# EAGLE design LB-BIT-w2_BRANCH-v03(3_3) (EAGLE 6.6.0)
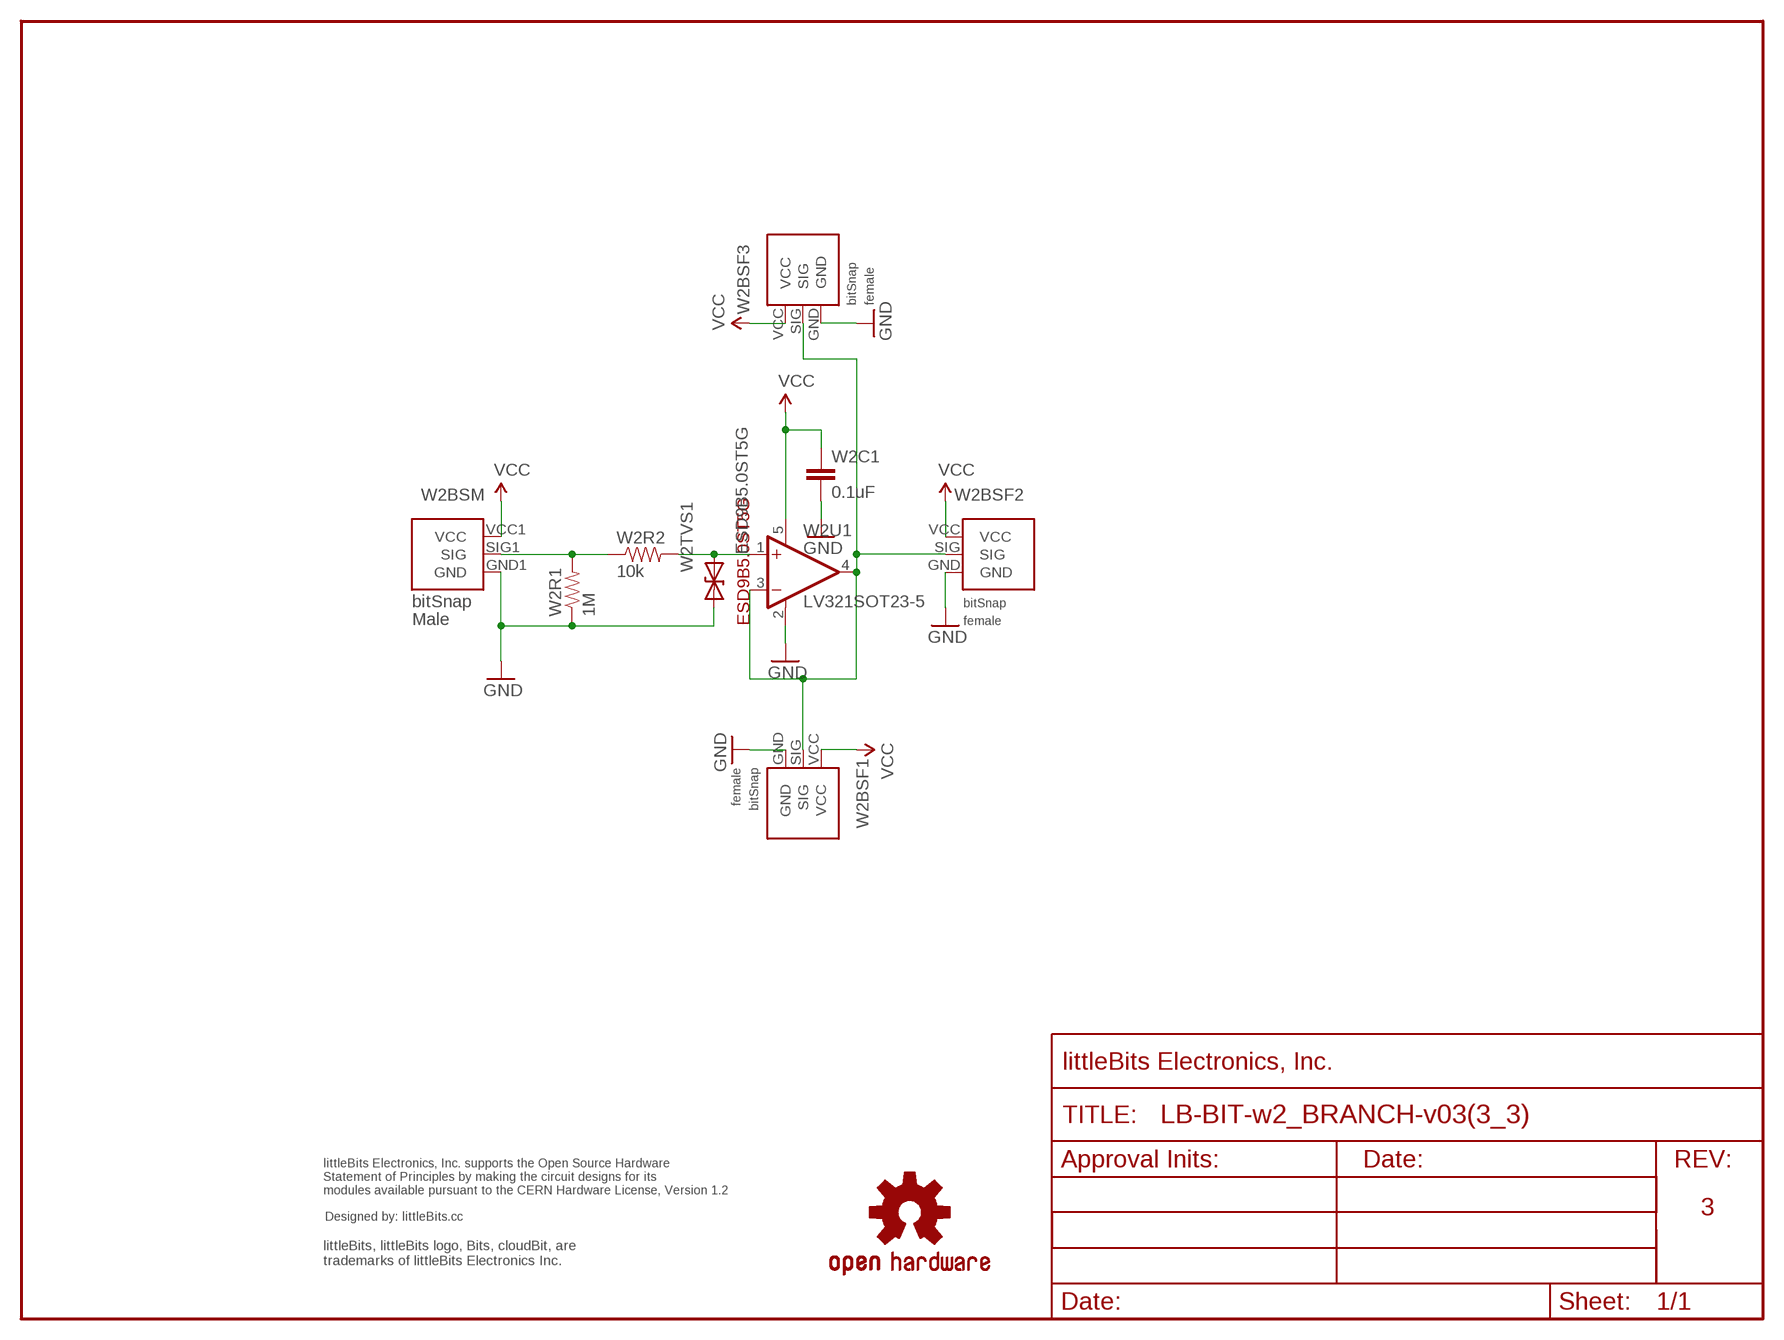
[diagram p0: schematic, sheet 1]

## Parts
U$1  OSHWCREDIT  [OSHWCREDIT]
U$2  FRAME-LETTER-OHWOHW  [FABDWG01-OHW]
U$6  OSHW-LOGOL  [OSHW-LOGO-L]
W2BSF1  BITSNAP_V03_FEMALE  [BITSNAP_V03_FEMALE]
W2BSF2  BITSNAP_V03_FEMALE  [BITSNAP_V03_FEMALE]
W2BSF3  BITSNAP_V03_FEMALE  [BITSNAP_V03_FEMALE]
W2BSM  BITSNAP_V03_MALE  [BITSNAP_V03_MALE]
W2C1  0.1uF  CAPCAP-0603  [CAP-0603]
W2R1  1M  RESISTOR0603  [RES-0603]
W2R2  10k  RESISTOR0603  [RES-0603]
W2TVS1  ESD9B5.0ST5G  DIODE-TVSSOD-923  [SOD-923]
W2U1  LV321SOT23-5  [SOT23-5]

## Nets
GND: W2BSF1.GND W2BSF2.GND W2BSF3.GND W2BSM.GND1(GND) W2C1.2 W2R1.1 W2TVS1.1(A) W2U1.2(V-)
N$1: W2BSM.SIG1(SIG) W2R1.2 W2R2.1
N$2: W2BSF1.SIG W2BSF2.SIG W2BSF3.SIG W2U1.3(-IN) W2U1.4(OUT)
N$3: W2R2.2 W2TVS1.2(C) W2U1.1(+IN)
VCC: W2BSF1.VCC W2BSF2.VCC W2BSF3.VCC W2BSM.VCC1(VCC) W2C1.1 W2U1.5(V+)

## Notes on the sheet
- 3

## Library data of the parts
U$1 = LITTLEBITS:OSHWCREDIT
U$2 = LITTLEBITS:FRAME-LETTER-OHW
U$6 = SparkFun_NEW:OSHW-LOGO: Open Source Hardware Logo This logo indicates the piece of hardware it is found on incorporates a OSHW license and/or adheres to the definition of open source hardware found here: http://freedomdefined.org/OSHW
W2BSF1-W2BSF3 = bitSnap:BITSNAP_V03_FEMALE
W2BSM = bitSnap:BITSNAP_V03_MALE
W2C1 = LITTLEBITS:CAP
W2R1 W2R2 = LITTLEBITS:RESISTOR
W2TVS1 = LITTLEBITS:DIODE-TVS: Bidirectional Transient Voltage Suppression Diode: Device conducts in avalanche mode after reaching a part dependent voltage threshold. Used for limiting voltage spikes on ESD sensitive inputs and outputs.; IEC_ESD_PROT0: +/-18kV; LB_PN: ?; MPN: ESD9B5.0ST5G; V_CLAMP: ?; V_OPERATION: 5V
W2U1 = LITTLEBITS:LV321

## Board
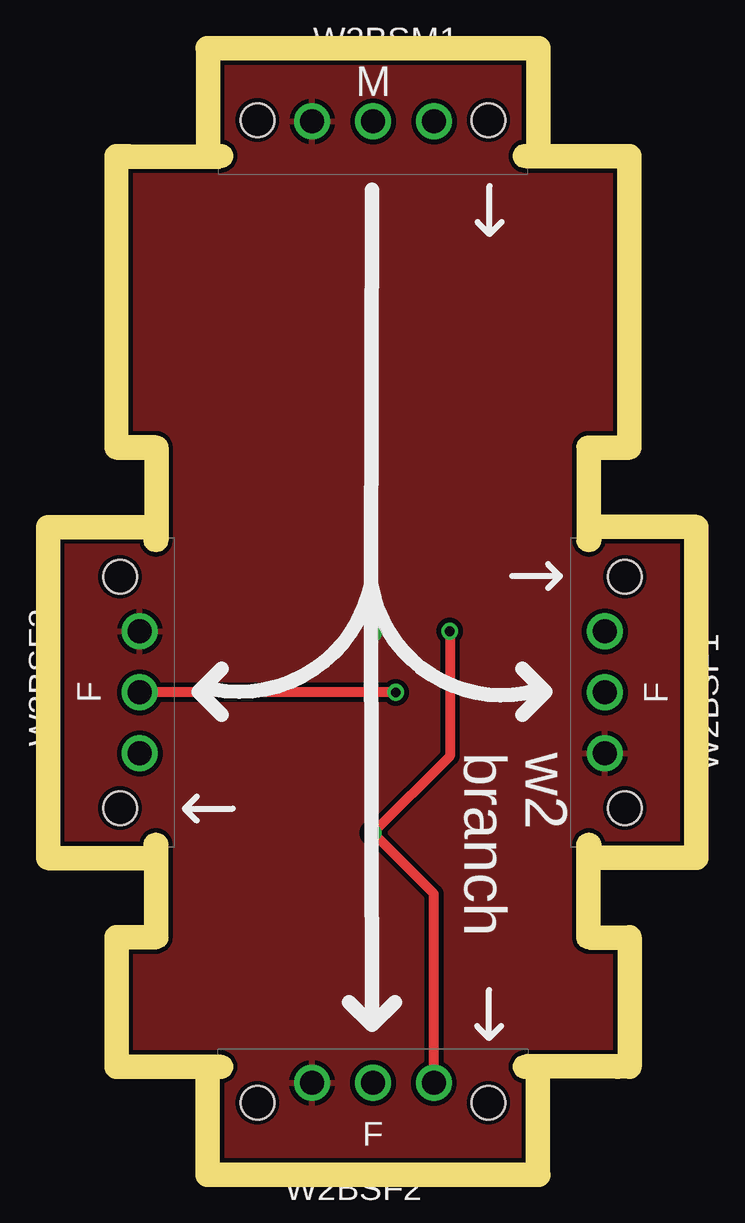
[diagram p1: board, top side]
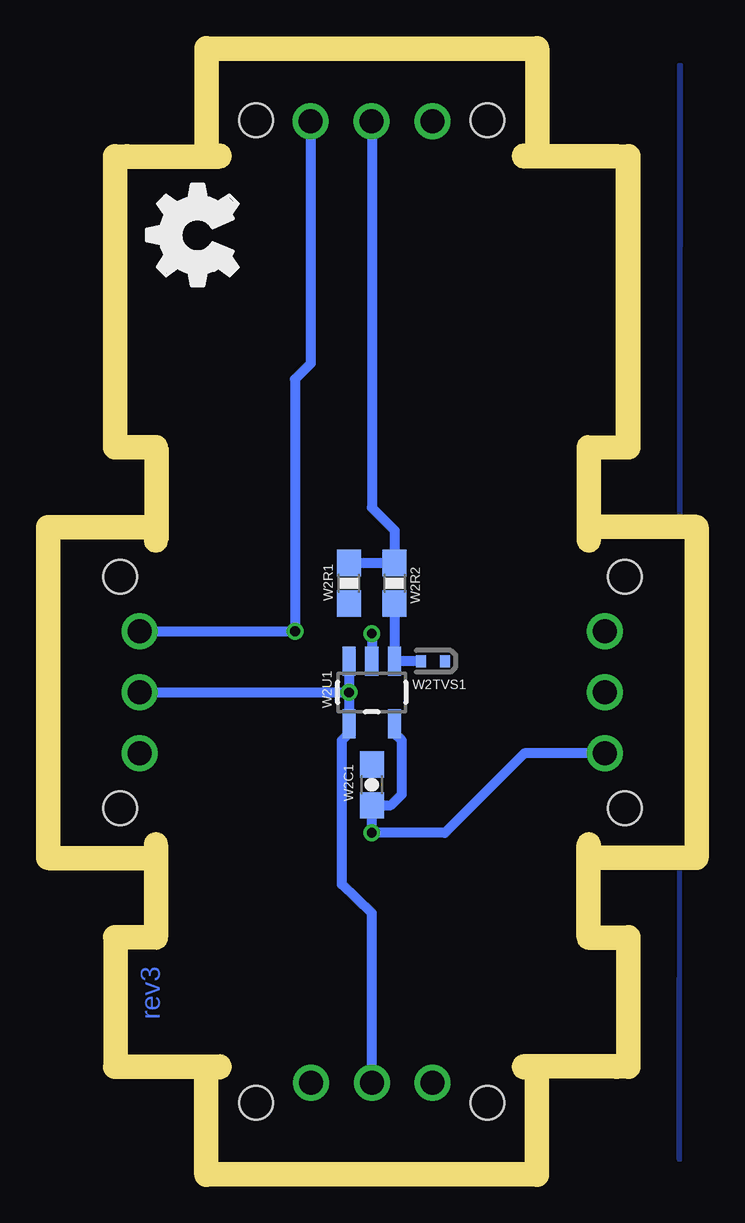
[diagram p2: board, bottom side, seen from below]

Size 26.05 x 45.95 mm. Coordinates in mm from the lower left corner, seen from the top.
Outline: 2.85,4.5 2.85,8.9 4,8.9 arc90 4.5,9.4
Outline: 23.25,4.5 23.25,8.9 22.05,8.9 arc-90 21.55,9.4
Outline: 2.85,41.45 2.85,30.3 4,30.3 arc-90 4.5,29.8
Outline: 23.25,41.45 23.25,30.3 22.05,30.3 arc90 21.55,29.8
Copper layers (1*16): Top 0.035mm / dielectric 1.5mm / Bottom 0.035mm
Design rules "default": minimum track width 0.2mm, minimum drill 0.4mm, track to track 0.2mm, track to pad 0.2mm, pad to pad 0.2mm, via to via 0.2mm, smd to smd 0mil, copper to edge 0.2mm, drill to drill 0.2mm, minimum pad ring 0.2mm, minimum via ring 0.15mm, stop-mask expansion 0.1mm, vias tented up to drill 0mil, thermal gap 0.2mm
Milling: 12 lines

### Footprints (pad centres in the part's own frame; a part is rotated, then mirrored left to right if it is on the bottom)
BITSNAP_V03_FEMALE = drill 1: GND 3.91,3.33; SIG 6.45,3.33; VCC 8.99,3.33 | hole 1.4: 1.63,2.5; 11.27,2.5
BITSNAP_V03_MALE = drill 1: GND1 8.98,2.56; SIG1 6.44,2.56; VCC1 3.9,2.56 | hole 1.4: 11.27,2.5; 1.63,2.5
CAP-0603 = smd 1.1 x 1: 1 -0.85,0; 2 0.85,0
RES-0603 = smd 1.1 x 1: 1 -0.85,0; 2 0.85,0
SOD-923 = smd 0.4 x 0.5: 1 -0.5,0; 2 0.5,0
SOT23-5 = smd 0.55 x 1.2: 1 -0.95,-1.3; 2 0,-1.3; 3 0.95,-1.3; 4 0.95,1.3; 5 -0.95,1.3

### Placement (x,y rotation side)
U$1  -87,-65.85 0 top  (outside the outline)
U$2  0.2,0.15 0 top
U$5  [OSHW_FILLX150_NOTEXT]  18.63,35.7 0 top
U$6  -91.64,-62.21 0 top  (outside the outline)
U$8  [AND/OR_OVERLAY]  2.6,-3.15 0 top  (outside the outline)
W2BSF1  26.05,13.15 90 top
W2BSF2  6.6,0 0 top
W2BSF3  0,26.05 270 top
W2BSM  19.5,45.95 180 top
W2C1  13.05,15.75 90 bottom
W2R1  14,24.15 90 bottom
W2R2  12.1,24.15 270 bottom
W2TVS1  10.5,20.9 180 bottom
W2U1  13.05,19.6 180 bottom

### Tracks (layer width: path | path; a pad name or v marks a point on that pad's centre or on a via)
GND  (via drill 0.41)
  Bottom 0.406: v13.05,22.05 13.05,22.15 W2U1.2
  pour Bottom (isolate 0.305): 0.17,45.74 0.22,45.74 0.22,0.12
  pour Top: 0.17,45.74 25.9,45.77 25.85,0.17 0.22,0.12
N$1
  Bottom 0.406: W2R1.2 W2R2.1 12.1,26.35 13.05,27.3 13.05,43.35 13.06,43.36 W2BSM.SIG1
N$2  (via drill 0.41)
  Top 0.406: v14,19.6 W2BSF3.SIG
  Bottom 0.406: W2BSF2.SIG 13.05,10.4 14.3,11.6 14.3,17.6 14,17.9 W2U1.4 | W2U1.4 14,18.78 W2U1.4 | v14,19.6 W2U1.3 14,20.95 | v14,19.6 14,19.5 | 14,19.5 W2U1.4 | v14,19.6 14,19.5 | W2U1.4 | W2BSF1.SIG v14,19.6
N$3
  Bottom 0.406: W2R2.2 W2U1.1 | W2TVS1.2 W2U1.1 | W2U1.1
VCC  (via drill 0.41)
  Top 0.406: W2BSF2.VCC 15.59,11.21 v13.05,13.75 16.25,16.95 v16.25,22.15
  Bottom 0.406: 15.55,43.44 W2BSM.VCC1 15.6,33.3 16.25,32.65 v16.25,22.15 | W2U1.5 12.1,17.9 11.8,17.6 11.8,15.35 12.25,14.9 W2C1.1 v13.05,13.75 10,13.75 6.69,17.06 W2BSF3.VCC | W2BSF1.VCC W2BSF1.VCC arc-90 22.7,22.15 16.3,22.15 | 16.3,22.15 arc-90 v16.25,22.15 | 16.3,22.15 v16.25,22.15

### Text on the board
Bottom: rev3
tPlace: branch | w2
tNames: W2BSM1 | W2BSF1 | W2BSF3 | W2BSF2
Milling: 1mm DIA. ROUTER PATH
Reference: XL
dxf: 3 | BRANCH BIT